# EAGLE schematic hackeeg-shield (EAGLE 9.6.2)

## Sheet 1 of 4: ADS1299 and power supplies
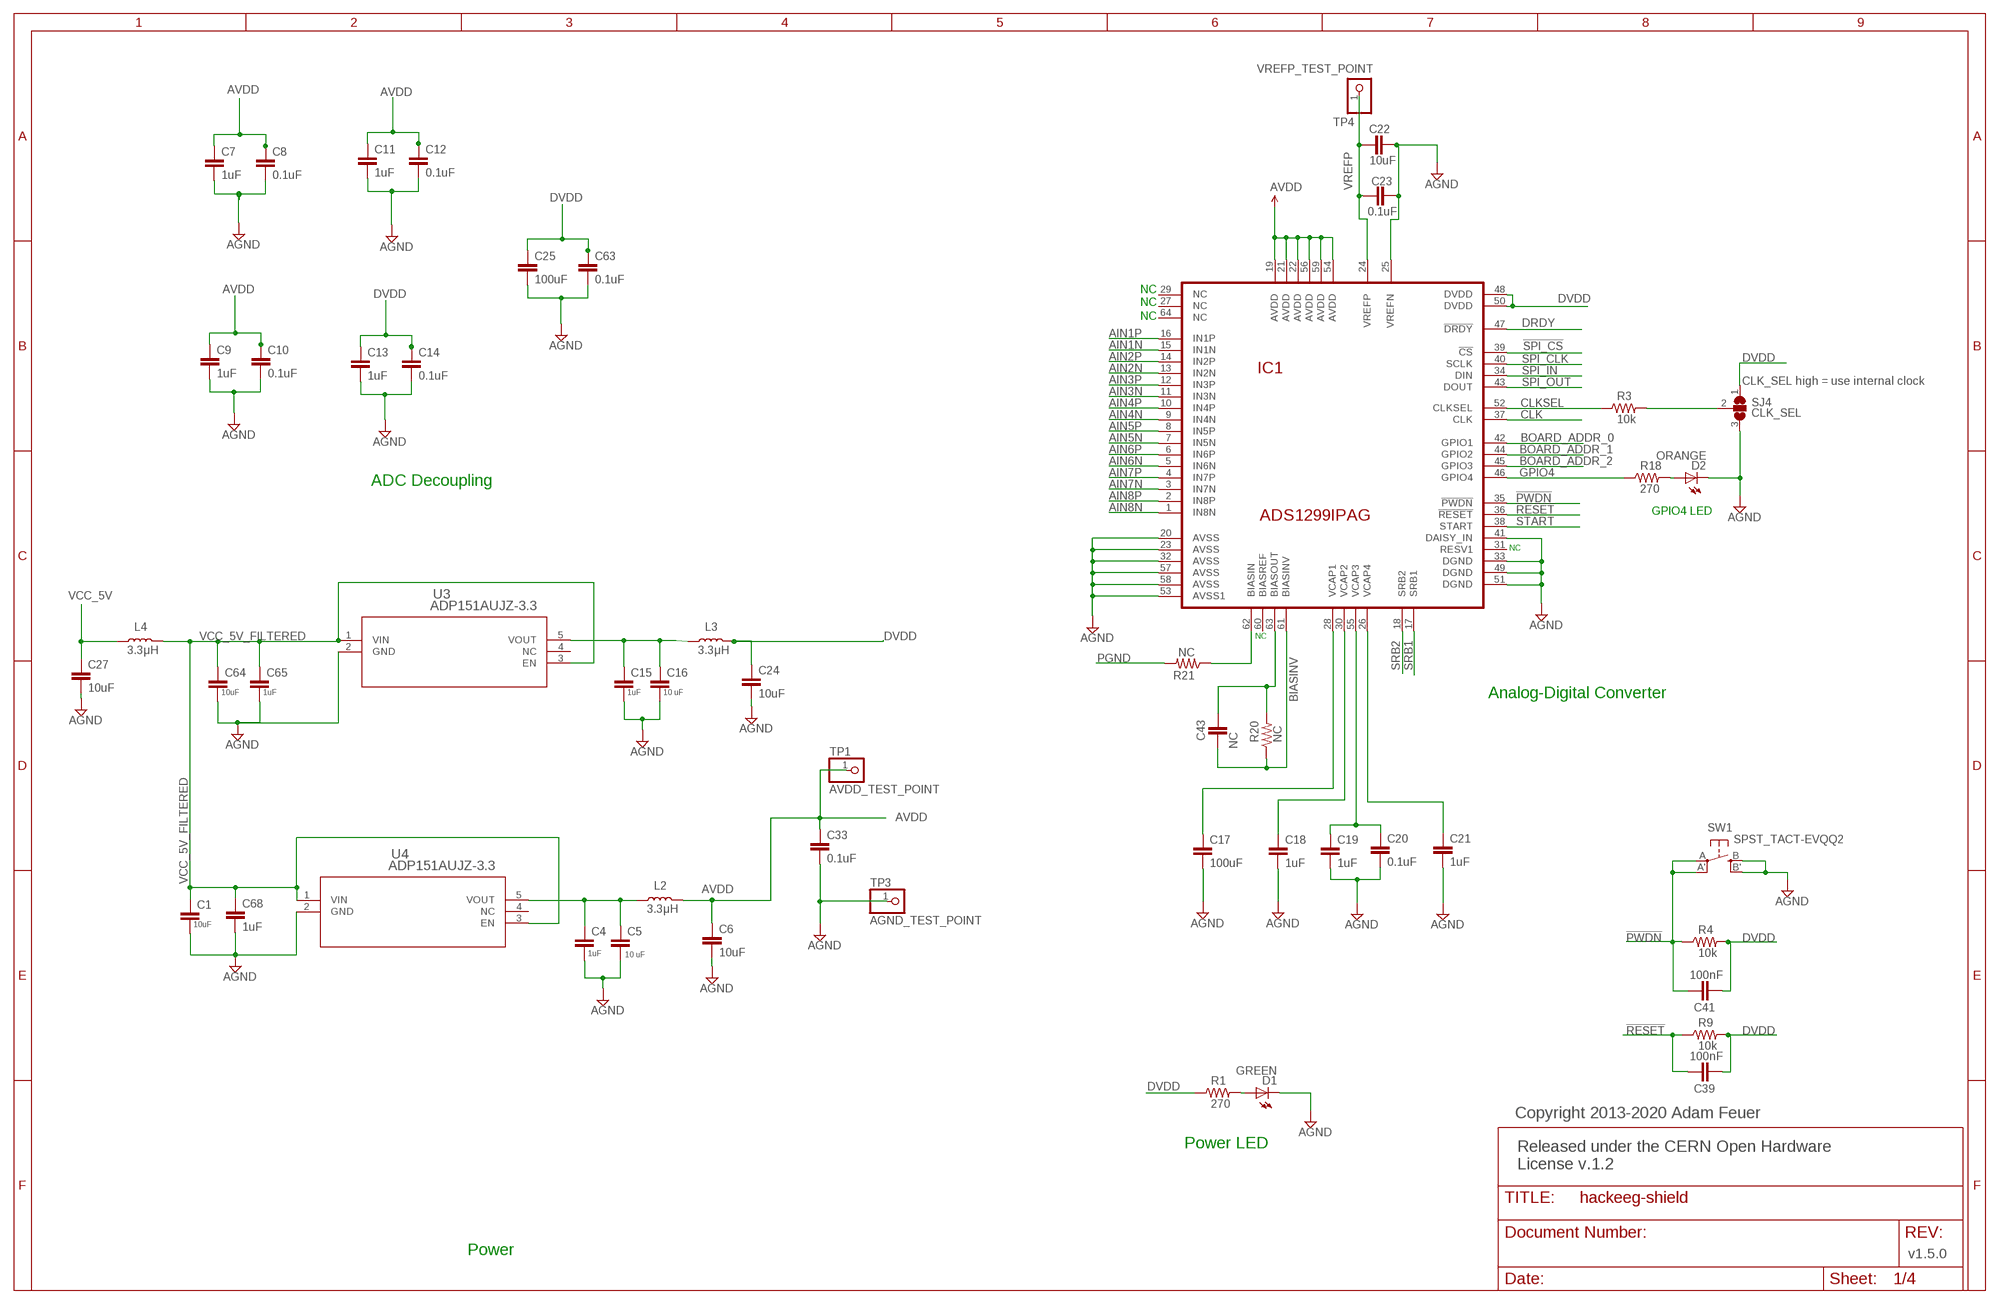
[diagram p0: schematic, sheet 1]

### Parts
C1  10uF  CAP0603-CAP  [0603-CAP]
C4  1uF  CAP0603-CAP  [0603-CAP]
C5  10 uF  CAP0603-CAP  [0603-CAP]
C6  10uF  CAP0603-CAP  [0603-CAP]
C7  1uF  CAP0603-CAP  [0603-CAP]
C8  0.1uF  CAP0603-CAP  [0603-CAP]
C9  1uF  CAP0603-CAP  [0603-CAP]
C10  0.1uF  CAP0603-CAP  [0603-CAP]
C11  1uF  CAP0603-CAP  [0603-CAP]
C12  0.1uF  CAP0603-CAP  [0603-CAP]
C13  1uF  CAP0603-CAP  [0603-CAP]
C14  0.1uF  CAP0603-CAP  [0603-CAP]
C15  1uF  CAP0603-CAP  [0603-CAP]
C16  10 uF  CAP0603-CAP  [0603-CAP]
C17  100uF  CAP1210  [1210]
C18  1uF  CAP0603-CAP  [0603-CAP]
C19  1uF  CAP0603-CAP  [0603-CAP]
C20  0.1uF  CAP0603-CAP  [0603-CAP]
C21  1uF  CAP0603-CAP  [0603-CAP]
C22  10uF  CAP0603-CAP  [0603-CAP]
C23  0.1uF  CAP0603-CAP  [0603-CAP]
C24  10uF  CAP0603-CAP  [0603-CAP]
C25  100uF  CAP1210  [1210]
C27  10uF  CAP0603-CAP  [0603-CAP]
C33  0.1uF  CAP0603-CAP  [0603-CAP]
C39  100nF  CAP0603-CAP  [0603-CAP]
C41  100nF  CAP0603-CAP  [0603-CAP]
C43  NC  CAP0603-CAP  [0603-CAP]
C63  0.1uF  CAP0603-CAP  [0603-CAP]
C64  10uF  CAP0603-CAP  [0603-CAP]
C65  1uF  CAP0603-CAP  [0603-CAP]
C68  1uF  CAP0603-CAP  [0603-CAP]
D1  GREEN  LED-RED1206  [LED-1206]
D2  ORANGE  LED-WHITE  [LED-1206]
IC1  ADS1299IPAG  ADS1299*PAG*  [TQFP64]
L2  3.3μH  1.0μH-0805_WIDE-1.0μH-1.4A-0.07OHM-1.4MM_H  [0805-WIDE]
L3  3.3μH  1.0μH-0805_WIDE-1.0μH-1.4A-0.07OHM-1.4MM_H  [0805-WIDE]
L4  3.3μH  1.0μH-0805_WIDE-1.0μH-1.4A-0.07OHM-1.4MM_H  [0805-WIDE]
R1  270  RESISTOR0603-RES  [0603-RES]
R3  10k  RESISTOR0603-RES  [0603-RES]
R4  10k  RESISTOR0603-RES  [0603-RES]
R9  10k  RESISTOR0603-RES  [0603-RES]
R18  270  RESISTOR0603-RES  [0603-RES]
R20  NC  RESISTOR0603-RES  [0603-RES]
R21  NC  RESISTOR0603-RES  [0603-RES]
SJ4  CLK_SEL  SJ2W  [SJ_2]
SW1  SPST_TACT-EVQQ2  [EVQ-Q2]
TP1  AVDD_TEST_POINT  PINHD-1X1  [1X01]
TP3  AGND_TEST_POINT  PINHD-1X1  [1X01]
TP4  VREFP_TEST_POINT  PINHD-1X1  [1X01]
U3  ADP151AUJZ-3.3  [UJ_5_ADI]
U4  ADP151AUJZ-3.3  [UJ_5_ADI]

### Nets
!PWDN: C41.1 IC1.35(!PWDN) R4.1 SW1.A'(P1) SW1.A(P)
!RESET: C39.1 IC1.36(!RESET) R9.1
!SPI_CS: IC1.39(!CS) ; also sheet 3
AGND: C1.2 C4.2 C5.2 C6.2 C7.2 C8.2 C9.2 C10.2 C11.2 C12.2 C13.2 C14.2 C15.2 C16.2 C17.2 C18.2 C19.2 C20.2 C21.2 C22.2 C23.2 C24.2 C25.2 C27.2 C33.2 C63.2 C64.2 C65.2 C68.2 D1.C D2.C IC1.20(AVSS) IC1.23(AVSS) IC1.25(VREFN) IC1.32(AVSS) IC1.33(DGND) IC1.41(DAISY_IN) IC1.49(DGND) IC1.51(DGND) IC1.53(AVSS1) IC1.57(AVSS) IC1.58(AVSS) SJ4.3 SW1.B'(S1) SW1.B(S) TP3.1 U3.2(GND) U4.2(GND) ; also sheet 2,3
AIN1N: IC1.15(IN1N) ; also sheet 2
AIN1P: IC1.16(IN1P) ; also sheet 2
AIN2N: IC1.13(IN2N) ; also sheet 2
AIN2P: IC1.14(IN2P) ; also sheet 2
AIN3N: IC1.11(IN3N) ; also sheet 2
AIN3P: IC1.12(IN3P) ; also sheet 2
AIN4N: IC1.9(IN4N) ; also sheet 2
AIN4P: IC1.10(IN4P) ; also sheet 2
AIN5N: IC1.7(IN5N) ; also sheet 2
AIN5P: IC1.8(IN5P) ; also sheet 2
AIN6N: IC1.5(IN6N) ; also sheet 2
AIN6P: IC1.6(IN6P) ; also sheet 2
AIN7N: IC1.3(IN7N) ; also sheet 2
AIN7P: IC1.4(IN7P) ; also sheet 2
AIN8N: IC1.1(IN8N) ; also sheet 2
AIN8P: IC1.2(IN8P) ; also sheet 2
AVDD: C6.1 C7.1 C8.1 C9.1 C10.1 C11.1 C12.1 C33.1 IC1.19(AVDD) IC1.21(AVDD) IC1.22(AVDD) IC1.54(AVDD) IC1.56(AVDD) IC1.59(AVDD) L2.2 TP1.1 ; also sheet 2
BIASINV: C43.2 IC1.61(BIASINV) R20.1 ; also sheet 2
BOARD_ADDR_0: IC1.42(GPIO1)
BOARD_ADDR_1: IC1.44(GPIO2)
BOARD_ADDR_2: IC1.45(GPIO3)
CLK: IC1.37(CLK) ; also sheet 3
CLKSEL: IC1.52(CLKSEL) R3.1
DRDY: IC1.47(!DRDY) ; also sheet 3
DVDD: C13.1 C14.1 C24.1 C25.1 C39.2 C41.2 C63.1 IC1.48(DVDD) IC1.50(DVDD) L3.2 R1.1 R4.2 R9.2 SJ4.1 ; also sheet 3
GPIO4: IC1.46(GPIO4) R18.1
N$1: C4.1 C5.1 L2.1 U4.5(VOUT)
N$2: C15.1 C16.1 L3.1 U3.5(VOUT)
N$3: C17.1 IC1.28(VCAP1)
N$4: C18.1 IC1.30(VCAP2)
N$5: C19.1 C20.1 IC1.55(VCAP3)
N$8: C21.1 IC1.26(VCAP4)
N$14: D2.A R18.2
N$19: D1.A R1.2
N$20: R3.2 SJ4.2
N$24: C43.1 IC1.63(BIASOUT) R20.2
N$25: IC1.62(BIASIN) R21.1
PGND: R21.2 ; also sheet 2
SPI_CLK: IC1.40(SCLK) ; also sheet 3
SPI_IN: IC1.34(DIN) ; also sheet 3
SPI_OUT: IC1.43(DOUT) ; also sheet 3
SRB1: IC1.17(SRB1) ; also sheet 2
SRB2: IC1.18(SRB2) ; also sheet 3
START: IC1.38(START) ; also sheet 3
VCC_5V: C27.1 L4.1 ; also sheet 3
VCC_5V_FILTERED: C1.1 C64.1 C65.1 C68.1 L4.2 U3.1(VIN) U3.3(EN) U4.1(VIN) U4.3(EN)
VREFP: C22.1 C23.1 IC1.24(VREFP) TP4.1
Unconnected: IC1.27(NC) IC1.29(NC) IC1.31(RESV1) IC1.60(BIASREF) IC1.64(NC) U3.4(NC) U4.4(NC)

### Notes on the sheet
- NC
- NC
- NC
- CLK_SEL high = use internal clock
- ADC Decoupling
- GPIO4 LED
- NC
- NC
- Analog-Digital Converter
- Copyright 2013-2020 Adam Feuer
- Power LED
- Released under the CERN Open Hardware 
  License v.1.2
- Power | v1.5.0

## Sheet 2 of 4: Input filtering and electrode connector
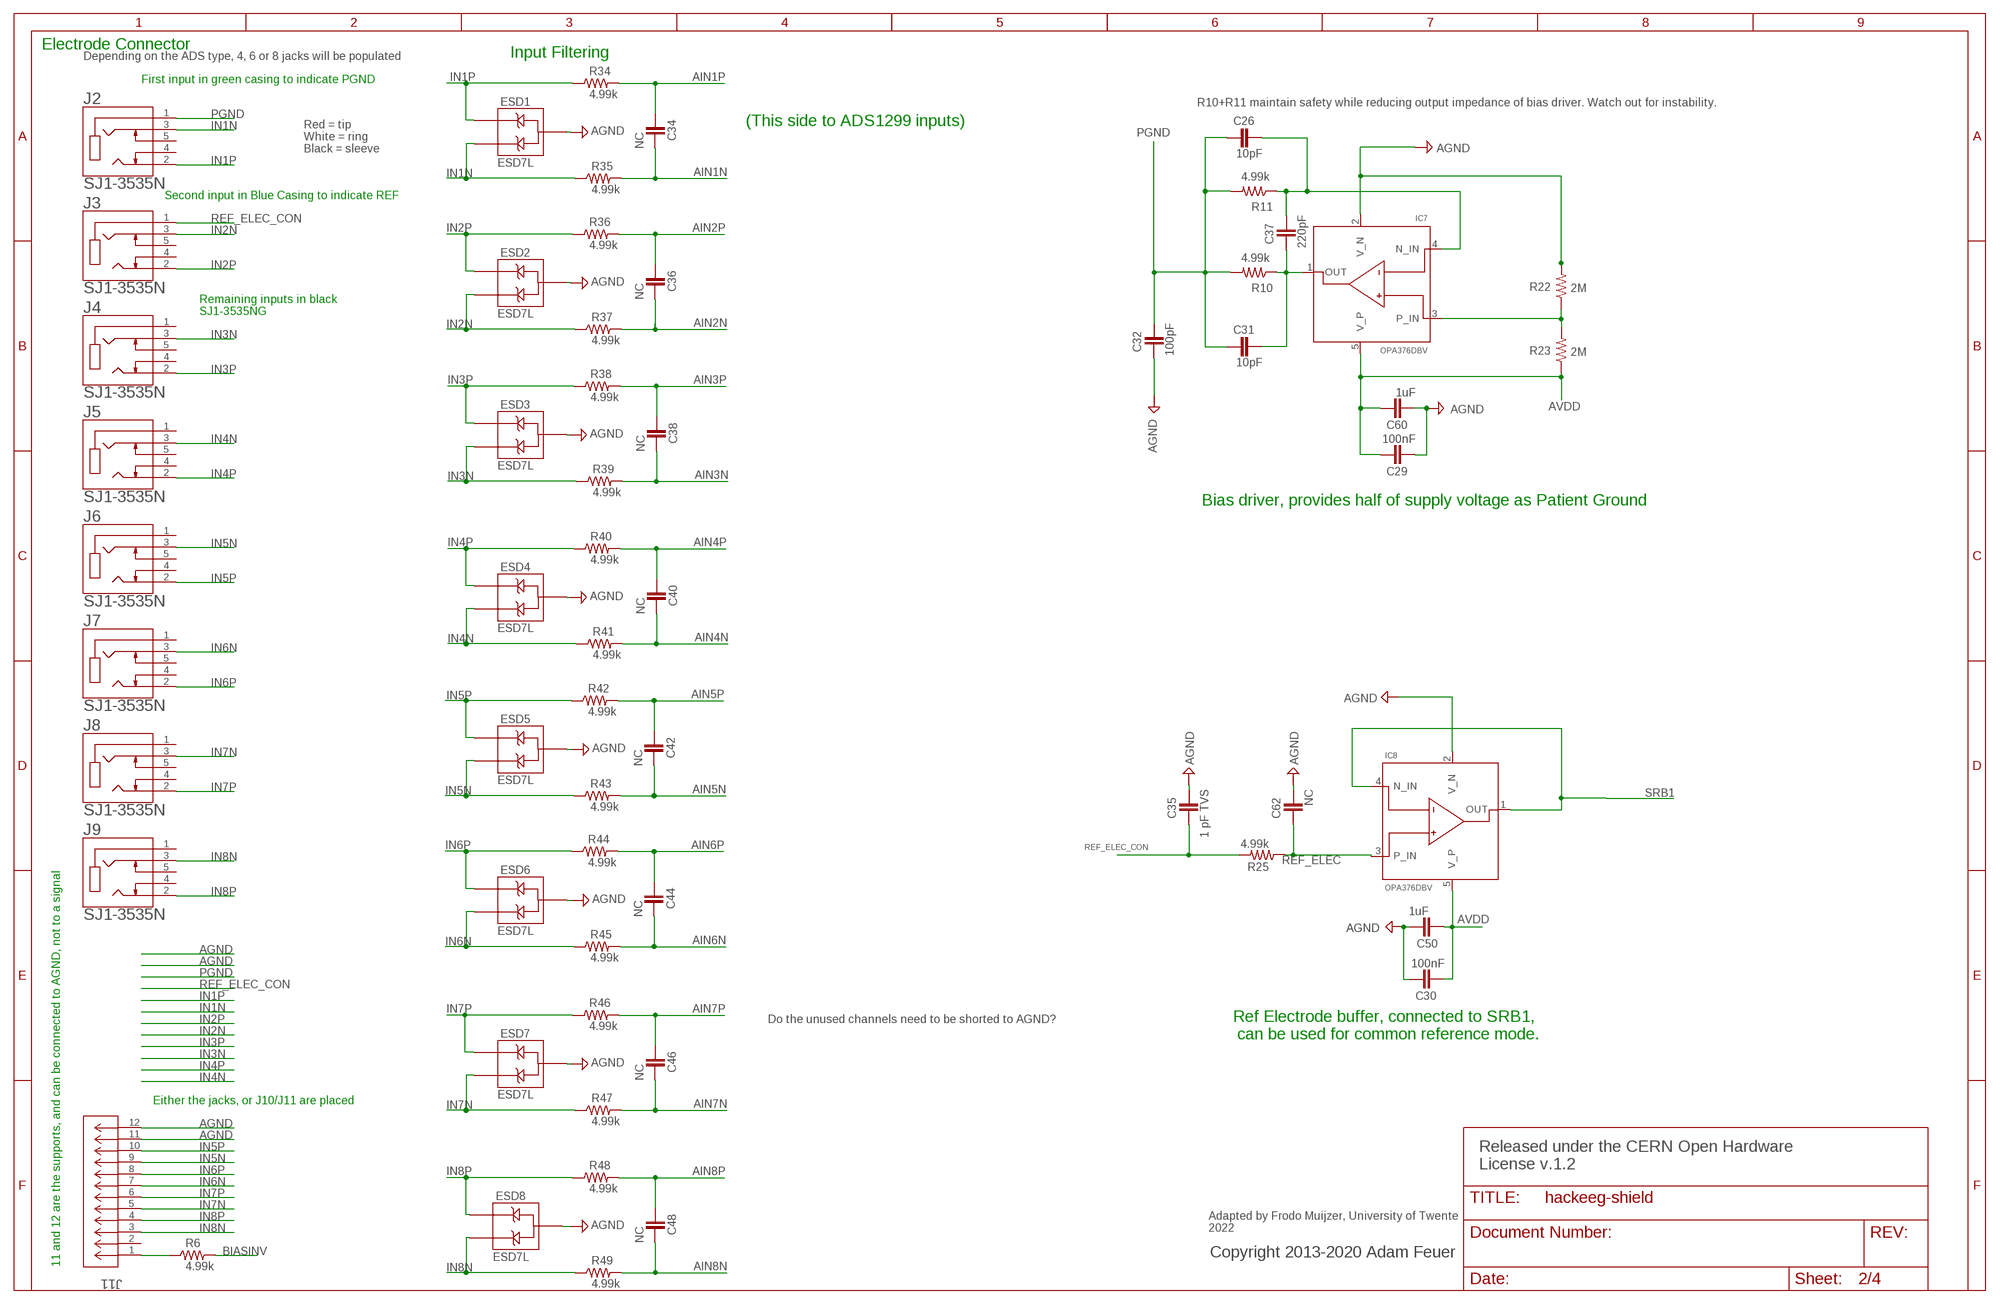
[diagram p1: schematic, sheet 2]

### Parts
C26  10pF  CAP0603-CAP  [0603-CAP]
C29  100nF  CAP0603-CAP  [0603-CAP]
C30  100nF  CAP0603-CAP  [0603-CAP]
C31  10pF  CAP0603-CAP  [0603-CAP]
C32  100pF  CAP0603-CAP  [0603-CAP]
C34  NC  CAP0603-CAP  [0603-CAP]
C35  1 pF TVS  CAP0603-CAP  [0603-CAP]
C36  NC  CAP0603-CAP  [0603-CAP]
C37  220pF  CAP0603-CAP  [0603-CAP]
C38  NC  CAP0603-CAP  [0603-CAP]
C40  NC  CAP0603-CAP  [0603-CAP]
C42  NC  CAP0603-CAP  [0603-CAP]
C44  NC  CAP0603-CAP  [0603-CAP]
C46  NC  CAP0603-CAP  [0603-CAP]
C48  NC  CAP0603-CAP  [0603-CAP]
C50  1uF  CAP0603-CAP  [0603-CAP]
C60  1uF  CAP0603-CAP  [0603-CAP]
C62  NC  CAP0603-CAP  [0603-CAP]
ESD1  ESD7L  [SOT-723]
ESD2  ESD7L  [SOT-723]
ESD3  ESD7L  [SOT-723]
ESD4  ESD7L  [SOT-723]
ESD5  ESD7L  [SOT-723]
ESD6  ESD7L  [SOT-723]
ESD7  ESD7L  [SOT-723]
ESD8  ESD7L  [SOT-723]
IC7  OPA376DBV  [SOT23-5]
IC8  OPA376DBV  [SOT23-5]
J2  SJ1-3535N  [CUI_SJ1-3535N]
J3  SJ1-3535N  [CUI_SJ1-3535N]
J4  SJ1-3535N  [CUI_SJ1-3535N]
J5  SJ1-3535N  [CUI_SJ1-3535N]
J6  SJ1-3535N  [CUI_SJ1-3535N]
J7  SJ1-3535N  [CUI_SJ1-3535N]
J8  SJ1-3535N  [CUI_SJ1-3535N]
J9  SJ1-3535N  [CUI_SJ1-3535N]
J11  533981071  [CON_533981071]
R6  4.99k  RESISTOR0603-RES  [0603-RES]
R10  4.99k  RESISTOR0603-RES  [0603-RES]
R11  4.99k  RESISTOR0603-RES  [0603-RES]
R22  2M  RESISTOR0603-RES  [0603-RES]
R23  2M  RESISTOR0603-RES  [0603-RES]
R25  4.99k  RESISTOR0603-RES  [0603-RES]
R34  4.99k  RESISTOR0603-RES  [0603-RES]
R35  4.99k  RESISTOR0603-RES  [0603-RES]
R36  4.99k  RESISTOR0603-RES  [0603-RES]
R37  4.99k  RESISTOR0603-RES  [0603-RES]
R38  4.99k  RESISTOR0603-RES  [0603-RES]
R39  4.99k  RESISTOR0603-RES  [0603-RES]
R40  4.99k  RESISTOR0603-RES  [0603-RES]
R41  4.99k  RESISTOR0603-RES  [0603-RES]
R42  4.99k  RESISTOR0603-RES  [0603-RES]
R43  4.99k  RESISTOR0603-RES  [0603-RES]
R44  4.99k  RESISTOR0603-RES  [0603-RES]
R45  4.99k  RESISTOR0603-RES  [0603-RES]
R46  4.99k  RESISTOR0603-RES  [0603-RES]
R47  4.99k  RESISTOR0603-RES  [0603-RES]
R48  4.99k  RESISTOR0603-RES  [0603-RES]
R49  4.99k  RESISTOR0603-RES  [0603-RES]

### Nets
AGND: C29.2 C30.1 C32.1 C35.2 C50.2 C60.2 C62.2 ESD1.P$3 ESD2.P$3 ESD3.P$3 ESD4.P$3 ESD5.P$3 ESD6.P$3 ESD7.P$3 ESD8.P$3 IC7.2(V_N) IC8.2(V_N) J11.11 J11.12 R22.2 ; also sheet 1,3
AIN1N: C34.2 R35.2 ; also sheet 1
AIN1P: C34.1 R34.2 ; also sheet 1
AIN2N: C36.2 R37.2 ; also sheet 1
AIN2P: C36.1 R36.2 ; also sheet 1
AIN3N: C38.2 R39.2 ; also sheet 1
AIN3P: C38.1 R38.2 ; also sheet 1
AIN4N: C40.2 R41.2 ; also sheet 1
AIN4P: C40.1 R40.2 ; also sheet 1
AIN5N: C42.2 R43.2 ; also sheet 1
AIN5P: C42.1 R42.2 ; also sheet 1
AIN6N: C44.2 R45.2 ; also sheet 1
AIN6P: C44.1 R44.2 ; also sheet 1
AIN7N: C46.2 R47.2 ; also sheet 1
AIN7P: C46.1 R46.2 ; also sheet 1
AIN8N: C48.2 R49.2 ; also sheet 1
AIN8P: C48.1 R48.2 ; also sheet 1
AVDD: C29.1 C30.2 C50.1 C60.1 IC7.5(V_P) IC8.5(V_P) R23.1 ; also sheet 1
BIASINV: R6.2 ; also sheet 1
IN1N: ESD1.P$2 J2.3 R35.1
IN1P: ESD1.P$1 J2.2 R34.1
IN2N: ESD2.P$2 J3.3 R37.1
IN2P: ESD2.P$1 J3.2 R36.1
IN3N: ESD3.P$2 J4.3 R39.1
IN3P: ESD3.P$1 J4.2 R38.1
IN4N: ESD4.P$2 J5.3 R41.1
IN4P: ESD4.P$1 J5.2 R40.1
IN5N: ESD5.P$2 J6.3 J11.9 R43.1
IN5P: ESD5.P$1 J6.2 J11.10 R42.1
IN6N: ESD6.P$2 J7.3 J11.7 R45.1
IN6P: ESD6.P$1 J7.2 J11.8 R44.1
IN7N: ESD7.P$2 J8.3 J11.5 R47.1
IN7P: ESD7.P$1 J8.2 J11.6 R46.1
IN8N: ESD8.P$2 J9.3 J11.3 R49.1
IN8P: ESD8.P$1 J9.2 J11.4 R48.1
N$10: J11.1 R6.1
N$15: IC7.3(P_IN) R22.1 R23.2
N$18: C31.2 C37.1 IC7.1(OUT) R10.1
N$54: C26.2 C37.2 IC7.4(N_IN) R11.1
PGND: C26.1 C31.1 C32.2 J2.1 R10.2 R11.2 ; also sheet 1
REF_ELEC: C62.1 IC8.3(P_IN) R25.1
REF_ELEC_CON: C35.1 J3.1 R25.2
SRB1: IC8.1(OUT) IC8.4(N_IN) ; also sheet 1
Unconnected: J2.4 J2.5 J3.4 J3.5 J4.1 J4.4 J4.5 J5.1 J5.4 J5.5 J6.1 J6.4 J6.5 J7.1 J7.4 J7.5 J8.1 J8.4 J8.5 J9.1 J9.4 J9.5 J11.2

### Notes on the sheet
- Electrode Connector
- Depending on the ADS type, 4, 6 or 8 jacks will be populated | Input Filtering
- First input in green casing to indicate PGND
- R10+R11 maintain safety while reducing output impedance of bias driver. Watch out for instability.
- (This side to ADS1299 inputs)
- Red = tip
  White = ring
  Black = sleeve
- Second input in Blue Casing to indicate REF
- Remaining inputs in black
  SJ1-3535NG
- Bias driver, provides half of supply voltage as Patient Ground
- Do the unused channels need to be shorted to AGND?
- Ref Electrode buffer, connected to SRB1,
   can be used for common reference mode.
- Either the jacks, or J10/J11 are placed
- Released under the CERN Open Hardware 
  License v.1.2
- Adapted by Frodo Muijzer, University of Twente
  2022
- Copyright 2013-2020 Adam Feuer
- 11 and 12 are the supports, and can be connected to AGND, not to a signal

## Sheet 3 of 4: Board to board connectors, isolation and additional connector.
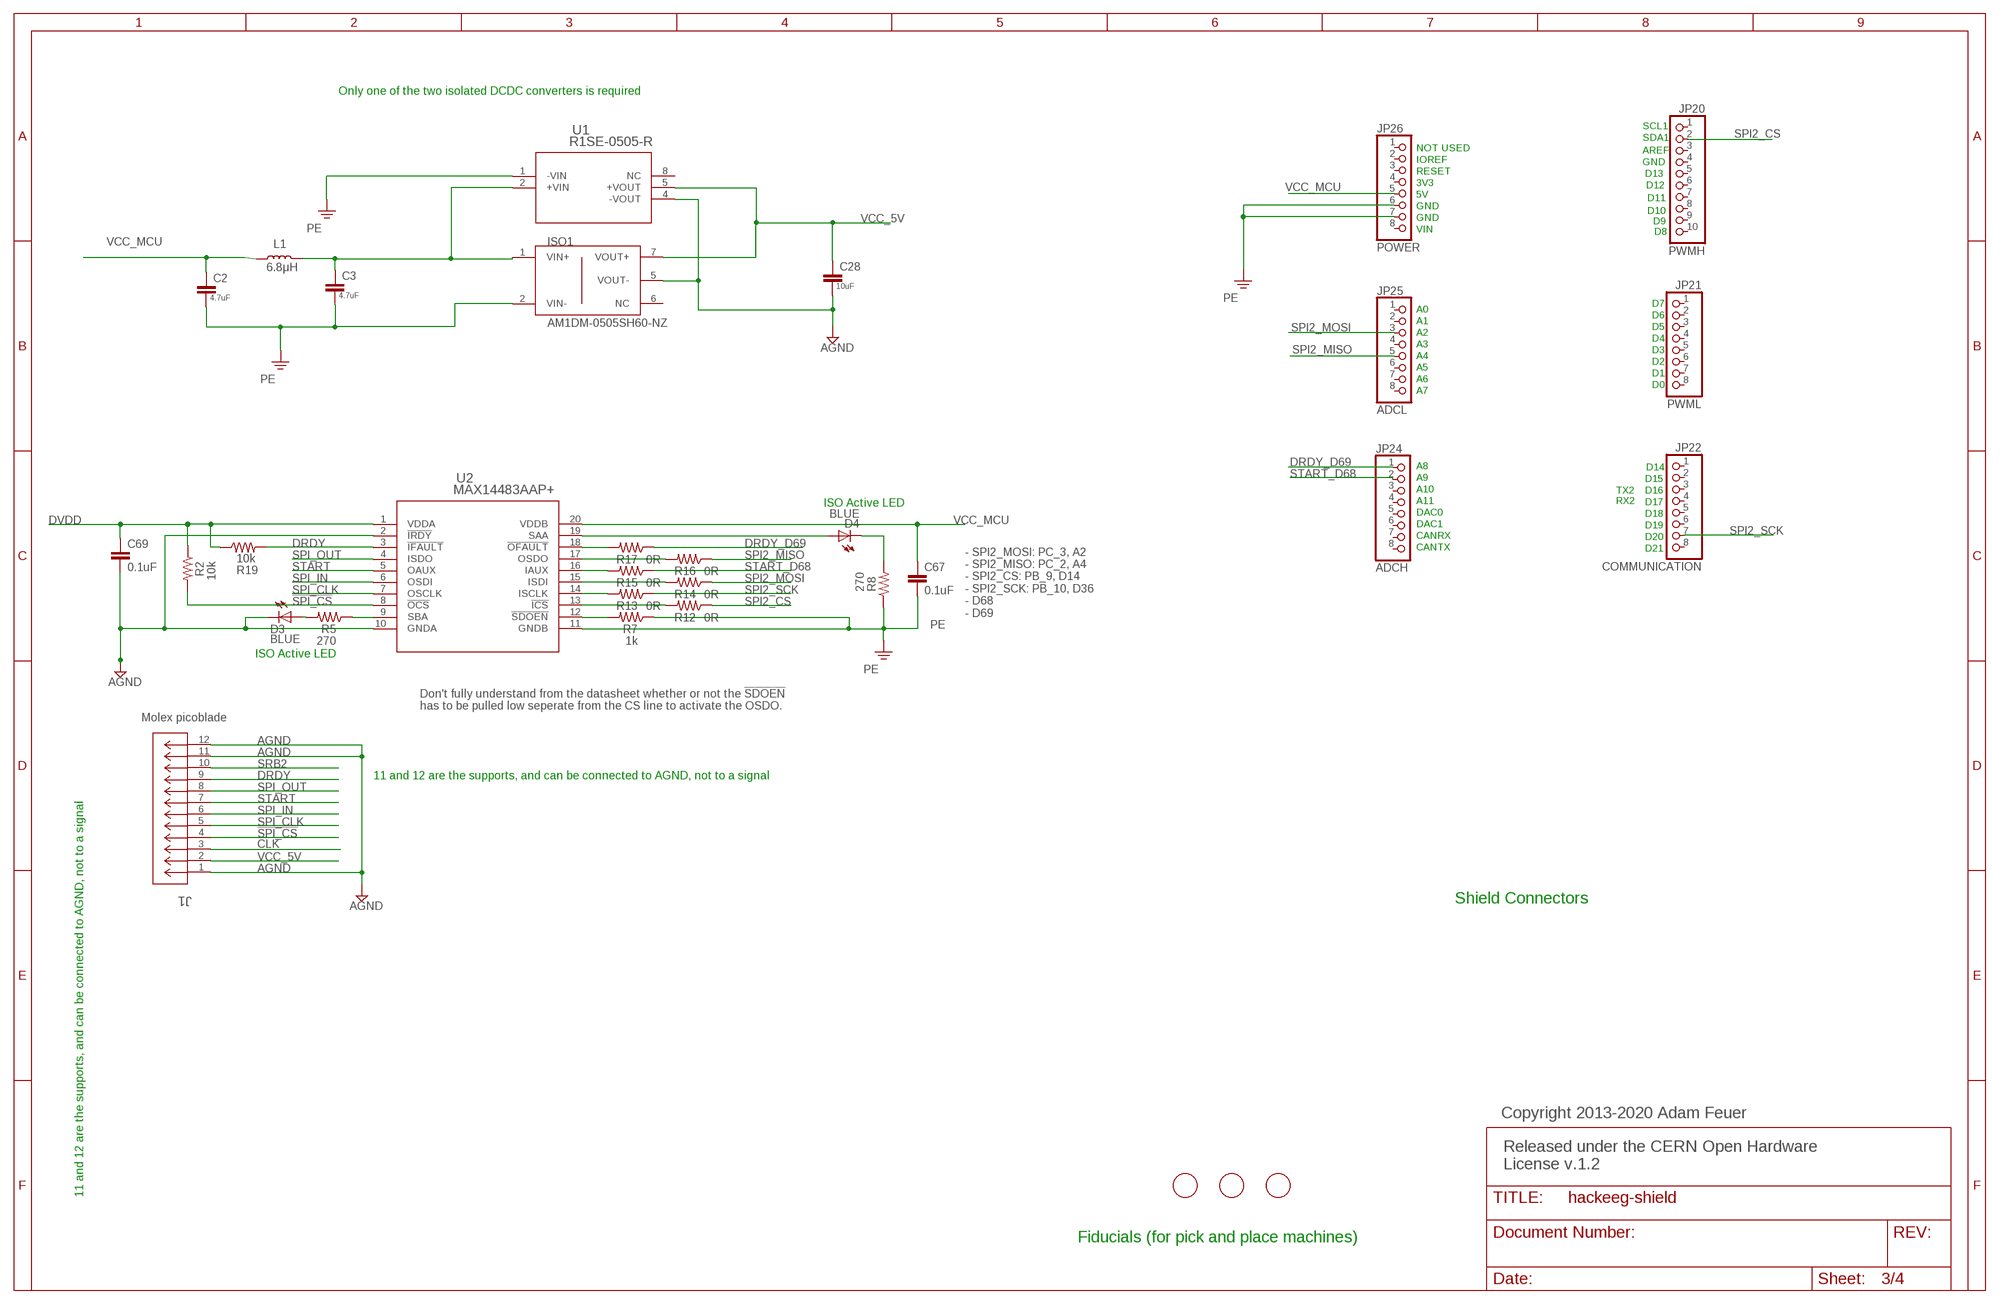
[diagram p2: schematic, sheet 3]

### Parts
C2  4.7uF  CAP0603-CAP  [0603-CAP]
C3  4.7uF  CAP0603-CAP  [0603-CAP]
C28  10uF  CAP0603-CAP  [0603-CAP]
C67  0.1uF  CAP0603-CAP  [0603-CAP]
C69  0.1uF  CAP0603-CAP  [0603-CAP]
D3  BLUE  LED-WHITE  [LED-1206]
D4  BLUE  LED-WHITE  [LED-1206]
ISO1  AM1DM-0505SH60-NZ  [SIP1005W50P254L1965H1265Q7]
J1  533981071  [CON_533981071]
JP20  PWMH  PINHD-1X10  [1X10]
JP21  PWML  PINHD-1X8  [1X08]
JP22  COMMUNICATION  PINHD-1X8  [1X08]
JP24  ADCH  PINHD-1X8  [1X08]
JP25  ADCL  PINHD-1X8  [1X08]
JP26  POWER  PINHD-1X8  [1X08]
L1  6.8μH  1.0μH-0805_WIDE-1.0μH-1.4A-0.07OHM-1.4MM_H  [0805-WIDE]
R2  10k  RESISTOR0603-RES  [0603-RES]
R5  270  RESISTOR0603-RES  [0603-RES]
R7  1k  RESISTOR0603-RES  [0603-RES]
R8  270  RESISTOR0603-RES  [0603-RES]
R12  0R  RESISTOR0603-RES  [0603-RES]
R13  0R  RESISTOR0603-RES  [0603-RES]
R14  0R  RESISTOR0603-RES  [0603-RES]
R15  0R  RESISTOR0603-RES  [0603-RES]
R16  0R  RESISTOR0603-RES  [0603-RES]
R17  0R  RESISTOR0603-RES  [0603-RES]
R19  10k  RESISTOR0603-RES  [0603-RES]
U1  R1SE-0505-R  [R1SE-0505-R_RCP]
U2  MAX14483AAP+  [21-0056C_20_MXM]
U$2  FIDUCIAL  [FIDUCIAL_1MM]
U$5  FIDUCIAL  [FIDUCIAL_1MM]
U$6  FIDUCIAL  [FIDUCIAL_1MM]

### Nets
!SPI_CS: J1.4 R2.2 U2.8(!OCS) ; also sheet 1
AGND: C28.2 C69.2 D3.C ISO1.5(VOUT-) J1.1 J1.11 J1.12 U1.4(-VOUT) U2.2(!IRDY) U2.10(GNDA) ; also sheet 1,2
CLK: J1.3 ; also sheet 1
DRDY: J1.9 R19.2 U2.3(!IFAULT) ; also sheet 1
DRDY_D69: JP24.1 R17.1
DVDD: C69.1 R2.1 R19.1 U2.1(VDDA) ; also sheet 1
N$6: C3.1 ISO1.1(VIN+) L1.2 U1.2(+VIN)
N$7: D4.A U2.19(SAA)
N$9: D3.A R5.2
N$11: R5.1 U2.9(SBA)
N$12: R17.2 U2.18(!OFAULT)
N$13: D4.C R8.2
N$16: R12.2 U2.13(!ICS)
N$17: R13.2 U2.14(ISCLK)
N$21: R14.2 U2.15(ISDI)
N$22: R15.2 U2.16(IAUX)
N$23: R16.2 U2.17(OSDO)
N$44: R7.2 U2.12(!SDOEN)
PE: C2.2 C3.2 C67.2 ISO1.2(VIN-) JP26.6 JP26.7 R7.1 R8.1 U1.1(-VIN) U2.11(GNDB)
SPI2_CS: JP20.2 R12.1
SPI2_MISO: JP25.5 R16.1
SPI2_MOSI: JP25.3 R14.1
SPI2_SCK: JP22.7 R13.1
SPI_CLK: J1.5 U2.7(OSCLK) ; also sheet 1
SPI_IN: J1.6 U2.6(OSDI) ; also sheet 1
SPI_OUT: J1.8 U2.4(ISDO) ; also sheet 1
SRB2: J1.10 ; also sheet 1
START: J1.7 U2.5(OAUX) ; also sheet 1
START_D68: JP24.2 R15.1
VCC_5V: C28.1 ISO1.7(VOUT+) J1.2 U1.5(+VOUT) ; also sheet 1
VCC_MCU: C2.1 C67.1 JP26.5 L1.1 U2.20(VDDB)
Unconnected: ISO1.6(NC) JP20.1 JP20.3 JP20.4 JP20.5 JP20.6 JP20.7 JP20.8 JP20.9 JP20.10 JP21.1 JP21.2 JP21.3 JP21.4 JP21.5 JP21.6 JP21.7 JP21.8 JP22.1 JP22.2 JP22.3 JP22.4 JP22.5 JP22.6 JP22.8 JP24.3 JP24.4 JP24.5 JP24.6 JP24.7 JP24.8 JP25.1 JP25.2 JP25.4 JP25.6 JP25.7 JP25.8 JP26.1 JP26.2 JP26.3 JP26.4 JP26.8 U1.8(NC)

### Notes on the sheet
- Only one of the two isolated DCDC converters is required
- SCL1
- SDA1
- NOT USED | AREF
- IOREF | GND
- RESET | D13
- 3V3 | D12
- 5V
- D11
- GND
- D10
- GND
- D9
- VIN | D8
- D7
- A0
- D6
- A1
- D5
- A2
- D4
- A3
- D3
- A4
- D2
- A5
- D1
- A6
- D0
- A7
- A8 | D14
- A9 | D15
- A10 | TX2 | D16
- ISO Active LED
- A11 | RX2 | D17
- DAC0 | D18
- DAC1 | D19
- CANRX | D20
- CANTX | D21
- - SPI2_MOSI: PC_3, A2 
  - SPI2_MISO: PC_2, A4 
  - SPI2_CS: PB_9, D14 
  - SPI2_SCK: PB_10, D36
  - D68
  - D69
- ISO Active LED
- Don't fully understand from the datasheet whether or not the !SDOEN
  has to be pulled low seperate from the CS line to activate the OSDO.
- Molex picoblade
- 11 and 12 are the supports, and can be connected to AGND, not to a signal
- Shield Connectors
- Copyright 2013-2020 Adam Feuer
- Released under the CERN Open Hardware 
  License v.1.2
- 11 and 12 are the supports, and can be connected to AGND, not to a signal
- Fiducials (for pick and place machines)

## Sheet 4 of 4: Nucleo headers
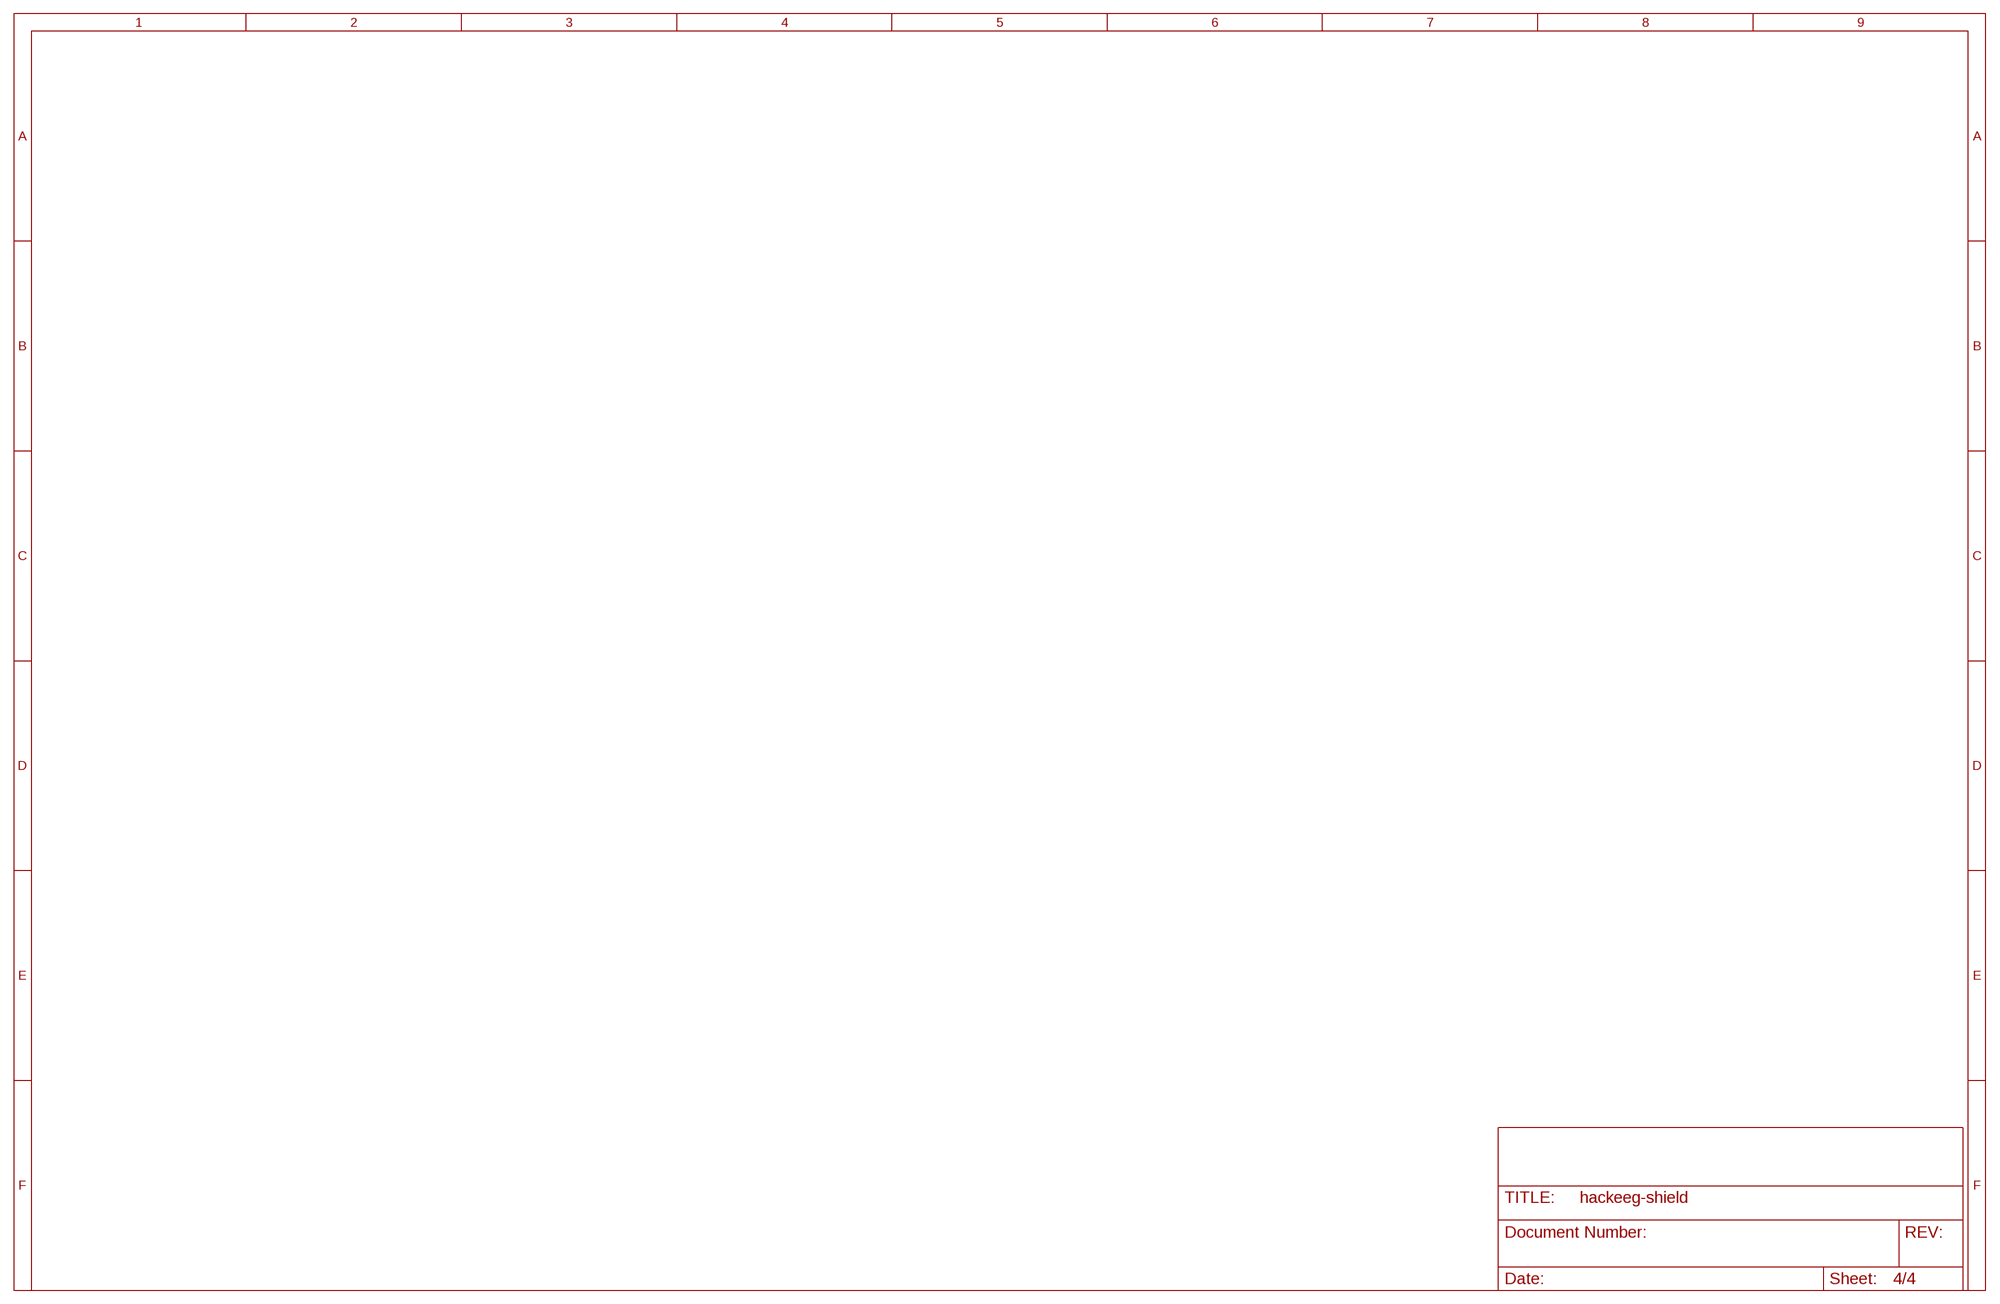
[diagram p3: schematic, sheet 4]

## Library data of the parts
C1-C44 C46 C48 C50 C60 C62-C65 C67-C69 = SparkFun-Passives:CAP: Capacitor Standard 0603 ceramic capacitor, and 0.1" leaded capacitor.
D1 = SparkFun-LED:LED-RED: Assorted Red LEDs LilyPad 1206- DIO-09912 1206- DIO-00809 0603- DIO-00819; PROD_ID: DIO-00809; VALUE: RED
D2-D4 = SparkFun-LED:LED-WHITE: White SMD LEDs LilyPad 1206- DIO-09955; PROD_ID: DIO-09955; VALUE: WHITE
ESD1-ESD8 = ESD7L:ESD7L: PolMar Check availability <https://pricing.snapeda.com/parts/ESD7L/ON%20Semiconductor/view-part?ref=eda>; AVAILABILITY: In Stock; DESCRIPTION: 10.4V Clamp 1A (8/20µs) Ipp Tvs Diode Surface Mount SOT-723; MF: ON Semiconductor; MP: ESD7L; PACKAGE: SOT-723 ON Semiconductor; PRICE: None; PURCHASE-URL: https://pricing.snapeda.com/search/part/ESD7L/?ref=eda
IC1 = ADS129x:ADS1299: 8-Channel, 24-Bit Analog-To-Digital Converter With Integrated EEG Front End. ADS1299 modifications by Adam Feuer (adam@adamfeuer.com) Based on ADS1298: Drawn 23.07.2011 by Tomasz Boleslaw CEDRO (http://www.tomek.cedro.info).
IC7 IC8 = OPA376:OPA376: Low-Noise, Low Quiescent Current, Precision Operational Amplifier
ISO1 = Aimtec AM1D:AM1DM-0505SH60-NZ: AM1DM-0505SH60-NZ - FEATURES: • 7 pin SIP package • High efficiency up to 81% • Reinforced insulation • Leakage current 2µA • Operating temperature -40° C to + 85° C • Isolation voltage: 4200VAC or 6000VDC • Ultra-low Isolation capacitance of 5pF • IEC/EN/UL60601-1 • 1xMOPP/2xMOOP
J1 J11 = Molex Picoblade 53398-1071:533981071; COPYRIGHT: Copyright (C) 2022 Ultra Librarian. All rights reserved.; MANUFACTURER_PART_NUMBER: 533981071; MFR_NAME: Molex Connector Corporation
J2-J9 = SJ1-3535N-a:SJ1-3535N: SJ1 Series 3.5 mm 12 V Right Angle Through Hole Isolated Stereo Audio Jack; MANUFACTURER: CUI; PARTREV: 1.01; STANDARD: Manufacturer recommendation
JP20 = SmartPrj:PINHD-1X10: PIN HEADER
JP21 JP22 JP24-JP26 = SmartPrj:PINHD-1X8: PIN HEADER
L1 = SparkFun-Coils:1.0μH: 1.0μH Inductor Resist changes in electrical current. Basically a coil of wire. SparkFun Products: SparkFun Edge <https://www.sparkfun.com/products/15170>; PROD_ID: NDUC-14237; SPICEPREFIX: L; VALUE: 1.0μH
L2-L4 = SparkFun-Coils:1.0μH: 1.0μH Inductor Resist changes in electrical current. Basically a coil of wire. SparkFun Products: SparkFun Edge <https://www.sparkfun.com/products/15170>; PROD_ID: NDUC-14237; VALUE: 1.0μH
R1-R23 R25 R34-R49 = SparkFun-Passives:RESISTOR: Resistor Basic schematic elements and footprints for 0603, 1206, and PTH resistors.
SJ4 = jumper:SJ2W: SMD solder JUMPER
SW1 = adafruit:SPST_TACT: SMT 6mm switch, EVQQ2 series http://www.ladyada.net/library/eagle
TP1 TP3 TP4 = adafruit:PINHD-1X1: Pin header 1x1 for 0.1" spacing With round pins
U1 = R1SE-0505-R:R1SE-0505-R; COPYRIGHT: Copyright (C) 2022 Ultra Librarian. All rights reserved.; MANUFACTURER_PART_NUMBER: R1SE-0505-R; MFR_NAME: Recom Power
U2 = MAX14483AAP:MAX14483AAP+; COPYRIGHT: Copyright (C) 2022 Ultra Librarian. All rights reserved.; MANUFACTURER_PART_NUMBER: MAX14483AAP+; MFR_NAME: Maxim Integrated Products
U3 U4 = ADP151AUJZ-3.3:ADP151AUJZ-3.3; COPYRIGHT: Copyright (C) 2022 Ultra Librarian. All rights reserved.; MANUFACTURER_PART_NUMBER: ADP151AUJZ-1.2-R7; MFR_NAME: Analog Devices Inc
U$2 U$5 U$6 = adafruit:FIDUCIAL: For use by pick and place machines to calibrate the vision/machine, 1mm By microbuilder.eu